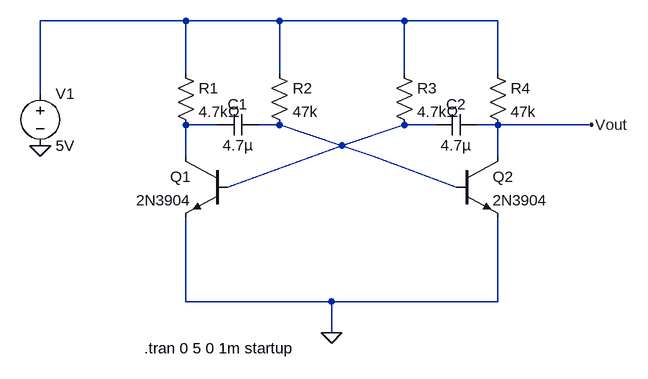
[diagram p0: schematic Draft2.asc]
Draft2.asc, the LTspice schematic file:
Version 4
SHEET 1 880 680
WIRE -80 -160 -304 -160
WIRE 64 -160 -80 -160
WIRE 256 -160 64 -160
WIRE 400 -160 256 -160
WIRE -80 -80 -80 -160
WIRE 64 -80 64 -160
WIRE 256 -80 256 -160
WIRE 400 -80 400 -160
WIRE -304 -48 -304 -160
WIRE -32 0 -80 0
WIRE 64 0 32 0
WIRE 304 0 256 0
WIRE 400 0 368 0
WIRE 544 0 400 0
WIRE 160 32 64 0
WIRE 160 32 256 0
WIRE -80 48 -80 0
WIRE 208 48 160 32
WIRE 400 48 400 0
WIRE -16 96 160 32
WIRE 336 96 208 48
WIRE -80 272 -80 144
WIRE 144 272 -80 272
WIRE 400 272 400 144
WIRE 400 272 144 272
WIRE 144 320 144 272
FLAG 144 320 0
FLAG -304 32 0
FLAG 544 0 Vout
SYMBOL npn 336 48 R0
SYMATTR InstName Q2
SYMATTR Value 2N3904
SYMBOL res -96 -96 R0
SYMATTR InstName R1
SYMATTR Value 4.7kΩ
SYMBOL npn -16 48 M0
SYMATTR InstName Q1
SYMATTR Value 2N3904
SYMBOL res 48 -96 R0
SYMATTR InstName R2
SYMATTR Value 47k
SYMBOL res 240 -96 R0
SYMATTR InstName R3
SYMATTR Value 4.7kΩ
SYMBOL res 384 -96 R0
SYMATTR InstName R4
SYMATTR Value 47k
SYMBOL cap 32 -16 R90
WINDOW 0 0 32 VBottom 2
WINDOW 3 32 32 VTop 2
SYMATTR InstName C1
SYMATTR Value 4.7µ
SYMBOL cap 304 -16 M90
WINDOW 0 0 32 VBottom 2
WINDOW 3 32 32 VTop 2
SYMATTR InstName C2
SYMATTR Value 4.7µ
SYMBOL voltage -304 -64 R0
SYMATTR InstName V1
SYMATTR Value 5V
TEXT -144 344 Left 2 !.tran 0 5 0 1m startup

The netlist it stands for:
* Draft2.asc
Q2 Vout N003 0 0 2N3904
R1 N001 N002 4.7kΩ
Q1 N002 N003 0 0 2N3904
R2 N001 N003 47k
R3 N001 N003 4.7kΩ
R4 N001 Vout 47k
C1 N003 N002 4.7µ
C2 N003 Vout 4.7µ
V1 N001 0 5V
.model NPN NPN
.model PNP PNP
.lib standard.bjt
.tran 0 5 0 1m startup
.backanno
.end

* Results of the author's LTspice run, read from the files saved beside the schematic
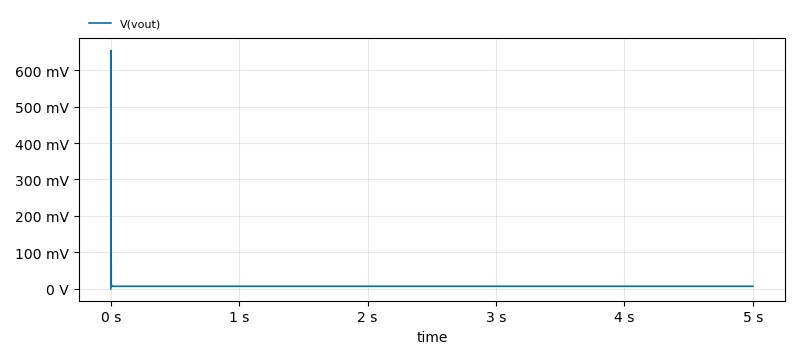
[diagram p1: Transient Analysis of Draft2.asc, plotted from the saved traces]
* Transient Analysis, 1 run:
*   V(vout): min 0 V, max 654.3 mV, average 7.116 mV, rms 12.09 mV, last 6.896 mV